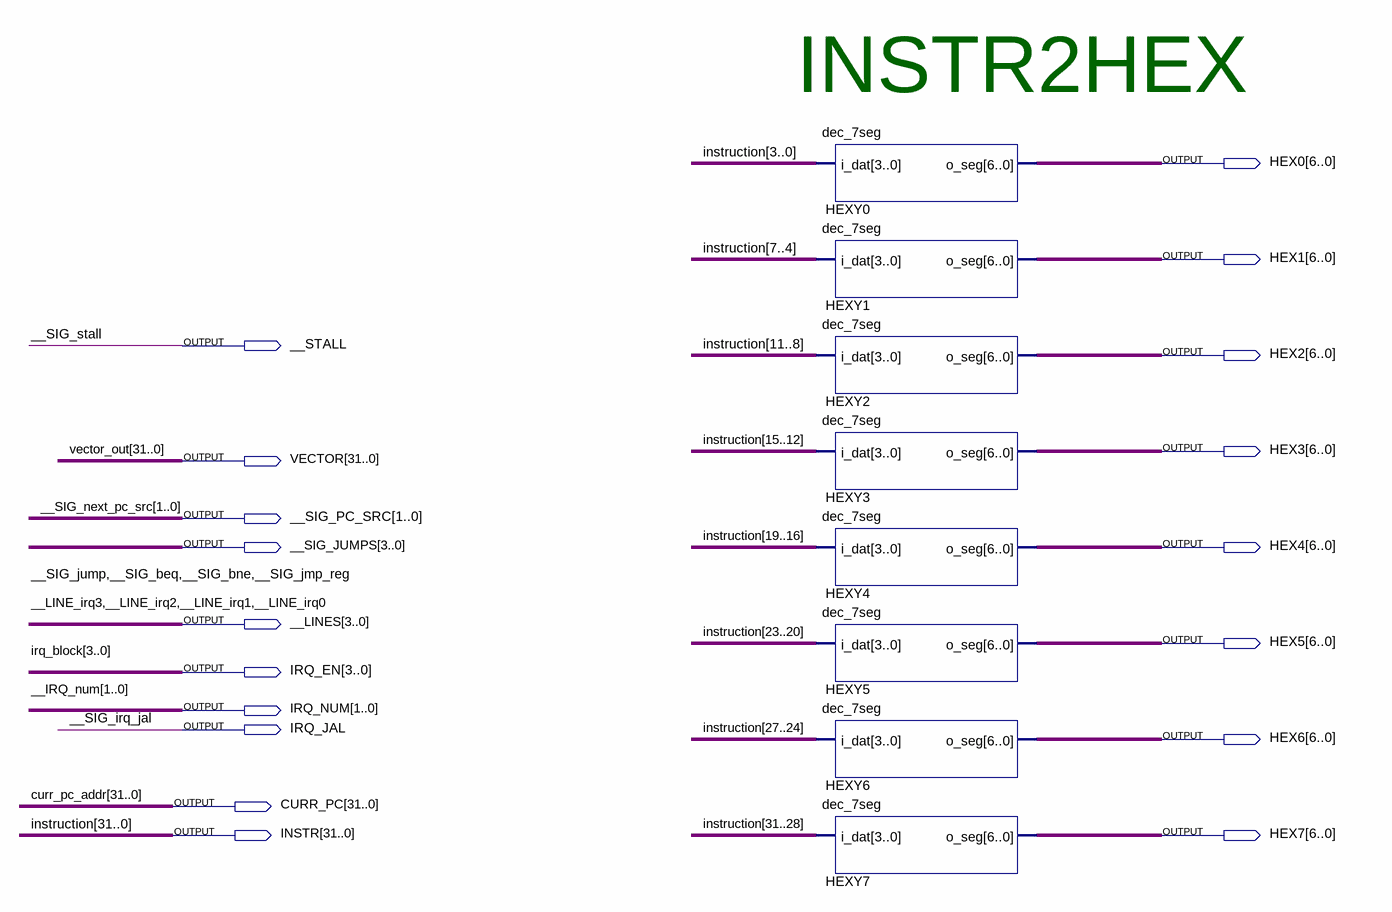
[diagram p0: schematic sheet]
// Quartus schematic dbg.bdf as structural Verilog: 8 symbols, 18 pins
module dbg (
  output [6:0] HEX0,
  output [6:0] HEX1,
  output __STALL,
  output [6:0] HEX2,
  output [6:0] HEX3,
  output [31:0] VECTOR,
  output [1:0] __SIG_PC_SRC,
  output [3:0] __SIG_JUMPS,
  output [6:0] HEX4,
  output [3:0] __LINES,
  output [6:0] HEX5,
  output [3:0] IRQ_EN,
  output [1:0] IRQ_NUM,
  output IRQ_JAL,
  output [6:0] HEX6,
  output [31:0] CURR_PC,
  output [31:0] INSTR,
  output [6:0] HEX7
);

  dec_7seg HEXY0 (.i_dat(INSTR[3:0]), .o_seg(HEX0));
  dec_7seg HEXY1 (.i_dat(INSTR[7:4]), .o_seg(HEX1));
  dec_7seg HEXY2 (.i_dat(INSTR[11:8]), .o_seg(HEX2));
  dec_7seg HEXY3 (.i_dat(INSTR[15:12]), .o_seg(HEX3));
  dec_7seg HEXY4 (.i_dat(INSTR[19:16]), .o_seg(HEX4));
  dec_7seg HEXY5 (.i_dat(INSTR[23:20]), .o_seg(HEX5));
  dec_7seg HEXY6 (.i_dat(INSTR[27:24]), .o_seg(HEX6));
  dec_7seg HEXY7 (.i_dat(INSTR[31:28]), .o_seg(HEX7));

  // Other names for the same wires on the sheet: __IRQ_num[1:0] = IRQ_NUM; __LINE_irq0 = __LINES[0];
  //   __LINE_irq1 = __LINES[1]; __LINE_irq2 = __LINES[2]; __LINE_irq3 = __LINES[3]; __SIG_beq = __SIG_JUMPS[2];
  //   __SIG_bne = __SIG_JUMPS[1]; __SIG_irq_jal = IRQ_JAL; __SIG_jmp_reg = __SIG_JUMPS[0];
  //   __SIG_jump = __SIG_JUMPS[3]; __SIG_next_pc_src[1:0] = __SIG_PC_SRC; __SIG_stall = __STALL;
  //   curr_pc_addr[31:0] = CURR_PC; instruction[31:0] = INSTR; irq_block[3:0] = IRQ_EN; vector_out[31:0] = VECTOR

  // Notes on the sheet:
  //   INSTR2HEX
endmodule
